# Altium schematic sheet AVR.SchDoc
size A4
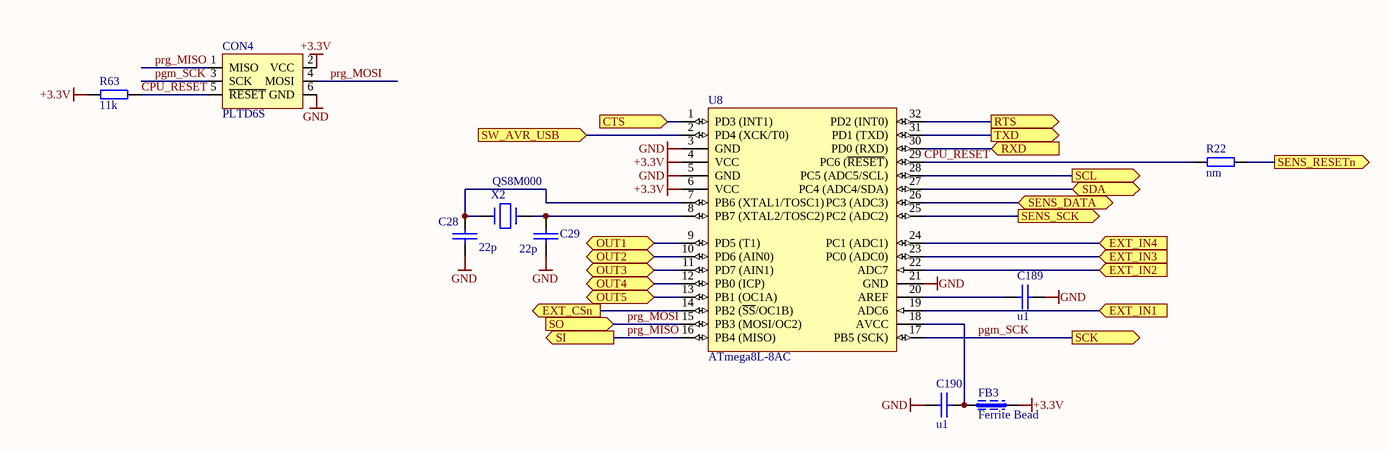
[diagram p0: AVR.SchDoc]

## Parts
C28  22p  [0603]
C29  22p  [0603]
C189  u1  [0603]
C190  u1  [0603]
CON4  PLTD6S  [PLTD6S]
FB3  Ferrite Bead  [0603]
R22  nm  [0603]
R63  11k  [0603]
U8  ATmega8L-8AC  [QFP32a]
X2  QS8M000  [HC-49SM]

## Ports
CTS (in), EXT_CSn (out), EXT_IN1 (in), EXT_IN2 (in), EXT_IN3 (in), EXT_IN4 (in), OUT1 (bidir), OUT2 (bidir), OUT3 (bidir), OUT4 (bidir), OUT5 (bidir), RTS (out), RXD (in), SCK (out), SCL (out), SDA (bidir), SENS_DATA (bidir), SENS_RESETn (out), SENS_SCK (out), SI (out), SO (in), SW_AVR_USB (in), TXD (out)

## Nets
+3.3V: CON4.2(VCC) FB3.2 R63.2 U8.4(VCC) U8.6(VCC)
GND: C28.1 C29.1 C189.2 C190.2 CON4.6(GND) U8.3(GND) U8.5(GND) U8.21(GND)
CPU_RESET: CON4.5(~{RESET}) R22.2 R63.1 U8.29(PC6_(~{RESET}))
CTS: U8.1(PD3_(INT1)) ; port CTS
EXT_CSn: U8.14(PB2_(~{SS}/OC1B)) ; port EXT_CSn
EXT_IN1: U8.19(ADC6) ; port EXT_IN1
EXT_IN2: U8.22(ADC7) ; port EXT_IN2
EXT_IN3: U8.23(PC0_(ADC0)) ; port EXT_IN3
EXT_IN4: U8.24(PC1_(ADC1)) ; port EXT_IN4
OUT1: U8.9(PD5_(T1)) ; port OUT1
OUT2: U8.10(PD6_(AIN0)) ; port OUT2
OUT3: U8.11(PD7_(AIN1)) ; port OUT3
OUT4: U8.12(PB0_(ICP)) ; port OUT4
OUT5: U8.13(PB1_(OC1A)) ; port OUT5
pgm_SCK: CON4.3(SCK) U8.17(PB5_(SCK)) ; port SCK
prg_MISO: CON4.1(MISO) U8.16(PB4_(MISO)) ; port SI
prg_MOSI: CON4.4(MOSI) U8.15(PB3_(MOSI/OC2)) ; port SO
RTS: U8.32(PD2_(INT0)) ; port RTS
RXD: U8.30(PD0_(RXD)) ; port RXD
SCL: U8.28(PC5_(ADC5/SCL)) ; port SCL
SDA: U8.27(PC4_(ADC4/SDA)) ; port SDA
SENS_DATA: U8.26(PC3_(ADC3)) ; port SENS_DATA
SENS_RESETn: R22.1 ; port SENS_RESETn
SENS_SCK: U8.25(PC2_(ADC2)) ; port SENS_SCK
SW_AVR_USB: U8.2(PD4_(XCK/T0)) ; port SW_AVR_USB
TXD: U8.31(PD1_(TXD)) ; port TXD
NetC28_2: C28.2 U8.7(PB6_(XTAL1/TOSC1)) X2.1
NetC29_2: C29.2 U8.8(PB7_(XTAL2/TOSC2)) X2.2
NetC189_1: C189.1 U8.20(AREF)
NetC190_1: C190.1 FB3.1 U8.18(AVCC)

## Library data of the parts
C28 C29 C189 C190 = CAP_SMD: Capacitor SMD
CON4 = CON_ISP
FB3 = L_FERRITE_BEAD
R22 R63 = RES_SMD: SMD Resistor
U8 = ATmega8-16AI: 8-Bit AVR Microcontroller with 8K Bytes of In-System Programmable Flash Memory; Package Information: Latest Revision: revB, Oct-2001; Code - JEDEC: MS-026-ABA; Published: 17-Sep-2003; Datasheet: Latest Revision: 2486H-AVR-09/02; Package Reference: 32A; Publisher: Altium Limited
X2 = CRYSTAL: Crystal oscillator